# Altium schematic sheet 07_ONB_COMPASS.SchDoc
size A4
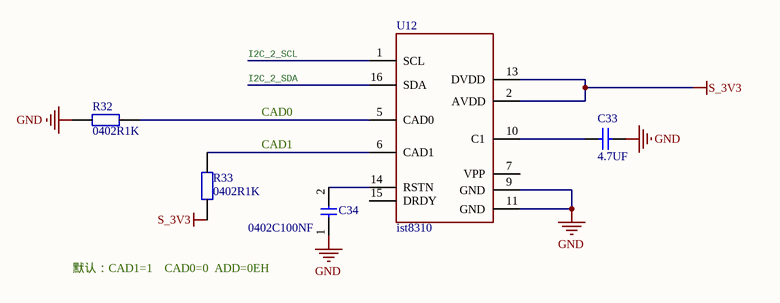
[diagram p0: 07_ONB_COMPASS.SchDoc]

## Parts
C33  4.7UF  [0805CAP]
C34  0402C100NF  [0402C]
R32  0402R1K  [0402R]
R33  0402R1K  [0402R]
U12  ist8310  [LGA16_4X4]

## Nets
GND: C33.2 C34.1 R32.2 U12.9(GND) U12.11(GND)
S_3V3: R33.1 U12.2(AVDD) U12.13(DVDD)
CAD0: R32.1 U12.5(CAD0)
CAD1: R33.2 U12.6(CAD1)
I2C_2_SCL: U12.1(SCL)
I2C_2_SDA: U12.16(SDA)
NetC33_1: C33.1 U12.10(C1)
NetC34_2: C34.2 U12.14(RSTN)

Not connected (* = marked no-connect by the designer): U12 7(VPP) 15(DRDY)

## Notes on the sheet
- Labels drawn without touching a wire or pin: 默认：CAD1=1    CAD0=0  ADD=0EH

## Library data of the parts
C33 = Cap: Capacitor
C34 = 0402C100NF: 50V 5%
R32 R33 = 0402R1K: 0402R1K 1%